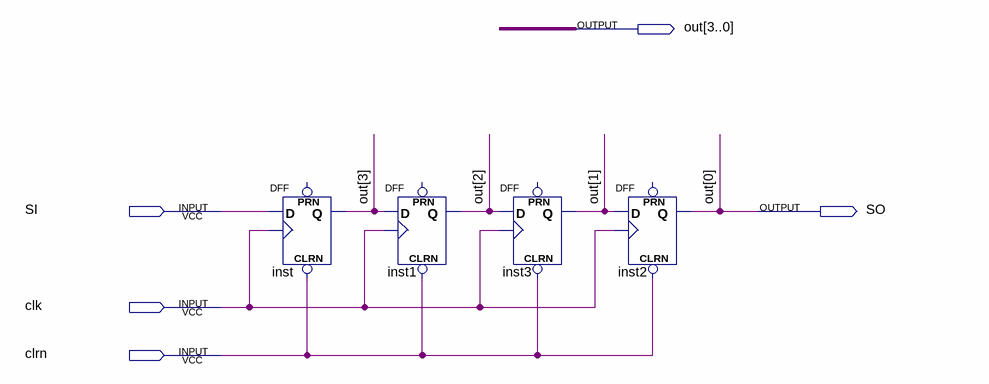
[diagram p0: schematic sheet]
// Quartus schematic srg4.bdf as structural Verilog: 4 symbols, 5 pins
module srg4 (
  input  SI,
  input  clk,
  input  clrn,
  output [3:0] out,
  output SO
);

  DFF inst (.CLRN(clrn), .CLK(clk), .D(SI), .Q(out[3]));  // open: PRN
  DFF inst1 (.CLRN(clrn), .CLK(clk), .D(out[3]), .Q(out[2]));  // open: PRN
  DFF inst3 (.CLRN(clrn), .CLK(clk), .D(out[2]), .Q(out[1]));  // open: PRN
  DFF inst2 (.CLRN(clrn), .CLK(clk), .D(out[1]), .Q(out[0]));  // open: PRN

  assign SO = out[0];
endmodule
